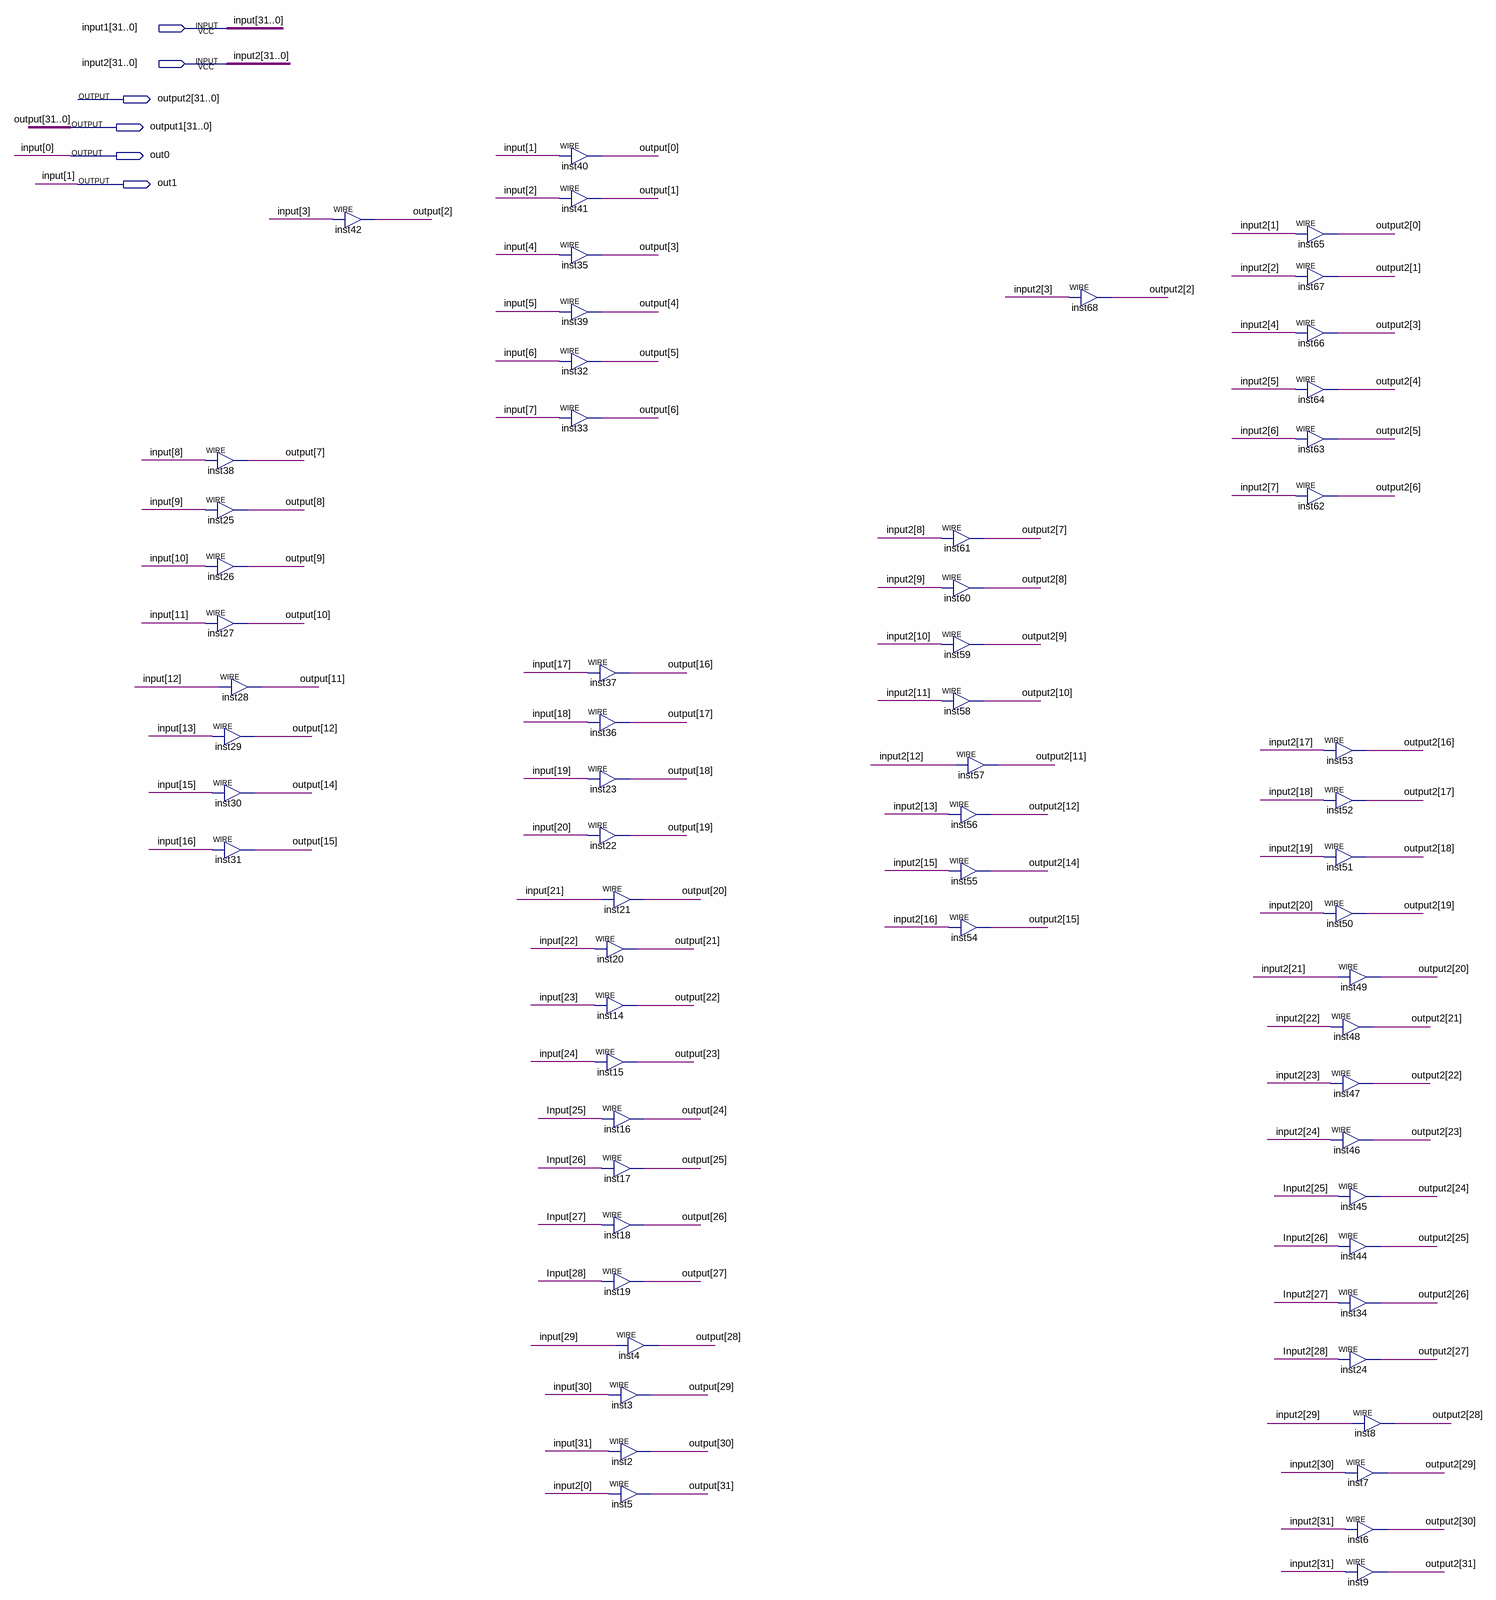
[diagram p0: schematic sheet]
// Quartus schematic barrel_shift.bdf as structural Verilog: 62 symbols, 6 pins
module barrel_shift (
  input  [31:0] input1,
  input  [31:0] input2,
  output [31:0] output2,
  output [31:0] output1,
  output out0,
  output out1
);

  assign output1[7] = input1[8];  // WIRE inst38
  assign output1[8] = input1[9];  // WIRE inst25
  assign output1[9] = input1[10];  // WIRE inst26
  assign output1[10] = input1[11];  // WIRE inst27
  assign output1[11] = input1[12];  // WIRE inst28
  assign output1[12] = input1[13];  // WIRE inst29
  assign output1[14] = input1[15];  // WIRE inst30
  assign output1[15] = input1[16];  // WIRE inst31
  assign output1[2] = input1[3];  // WIRE inst42
  assign output1[0] = input1[1];  // WIRE inst40
  assign output1[1] = input1[2];  // WIRE inst41
  assign output1[3] = input1[4];  // WIRE inst35
  assign output1[4] = input1[5];  // WIRE inst39
  assign output1[5] = input1[6];  // WIRE inst32
  assign output1[6] = input1[7];  // WIRE inst33
  assign output1[16] = input1[17];  // WIRE inst37
  assign output1[17] = input1[18];  // WIRE inst36
  assign output1[18] = input1[19];  // WIRE inst23
  assign output1[19] = input1[20];  // WIRE inst22
  assign output1[20] = input1[21];  // WIRE inst21
  assign output1[21] = input1[22];  // WIRE inst20
  assign output1[22] = input1[23];  // WIRE inst14
  assign output1[23] = input1[24];  // WIRE inst15
  assign output1[24] = input1[25];  // WIRE inst16
  assign output1[25] = input1[26];  // WIRE inst17
  assign output1[26] = input1[27];  // WIRE inst18
  assign output1[27] = input1[28];  // WIRE inst19
  assign output1[28] = input1[29];  // WIRE inst4
  assign output1[29] = input1[30];  // WIRE inst3
  assign output1[30] = input1[31];  // WIRE inst2
  assign output1[31] = input2[0];  // WIRE inst5
  assign output2[7] = input2[8];  // WIRE inst61
  assign output2[8] = input2[9];  // WIRE inst60
  assign output2[9] = input2[10];  // WIRE inst59
  assign output2[10] = input2[11];  // WIRE inst58
  assign output2[11] = input2[12];  // WIRE inst57
  assign output2[12] = input2[13];  // WIRE inst56
  assign output2[14] = input2[15];  // WIRE inst55
  assign output2[15] = input2[16];  // WIRE inst54
  assign output2[2] = input2[3];  // WIRE inst68
  assign output2[0] = input2[1];  // WIRE inst65
  assign output2[1] = input2[2];  // WIRE inst67
  assign output2[3] = input2[4];  // WIRE inst66
  assign output2[4] = input2[5];  // WIRE inst64
  assign output2[5] = input2[6];  // WIRE inst63
  assign output2[6] = input2[7];  // WIRE inst62
  assign output2[16] = input2[17];  // WIRE inst53
  assign output2[17] = input2[18];  // WIRE inst52
  assign output2[18] = input2[19];  // WIRE inst51
  assign output2[19] = input2[20];  // WIRE inst50
  assign output2[20] = input2[21];  // WIRE inst49
  assign output2[21] = input2[22];  // WIRE inst48
  assign output2[22] = input2[23];  // WIRE inst47
  assign output2[23] = input2[24];  // WIRE inst46
  assign output2[24] = input2[25];  // WIRE inst45
  assign output2[25] = input2[26];  // WIRE inst44
  assign output2[26] = input2[27];  // WIRE inst34
  assign output2[27] = input2[28];  // WIRE inst24
  assign output2[28] = input2[29];  // WIRE inst8
  assign output2[29] = input2[30];  // WIRE inst7
  assign output2[30] = input2[31];  // WIRE inst6
  assign output2[31] = input2[31];  // WIRE inst9

  assign out0 = input1[0];
  assign out1 = input1[1];

  // Other names for the same wires on the sheet: input[31:0] = input1; output[31:0] = output1
endmodule
